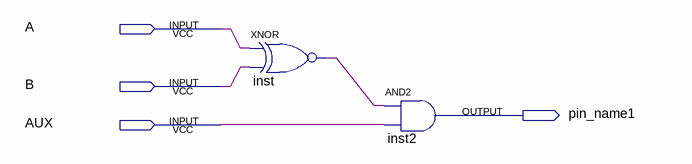
[diagram p0: schematic sheet]
// Quartus schematic module_1b_comparator.bdf as structural Verilog: 2 symbols, 4 pins
module module_1b_comparator (
  input  A,
  input  B,
  input  AUX,
  output pin_name1
);

  wire inst_out;

  xnor inst (inst_out, A, B);
  and inst2 (pin_name1, inst_out, AUX);
endmodule
